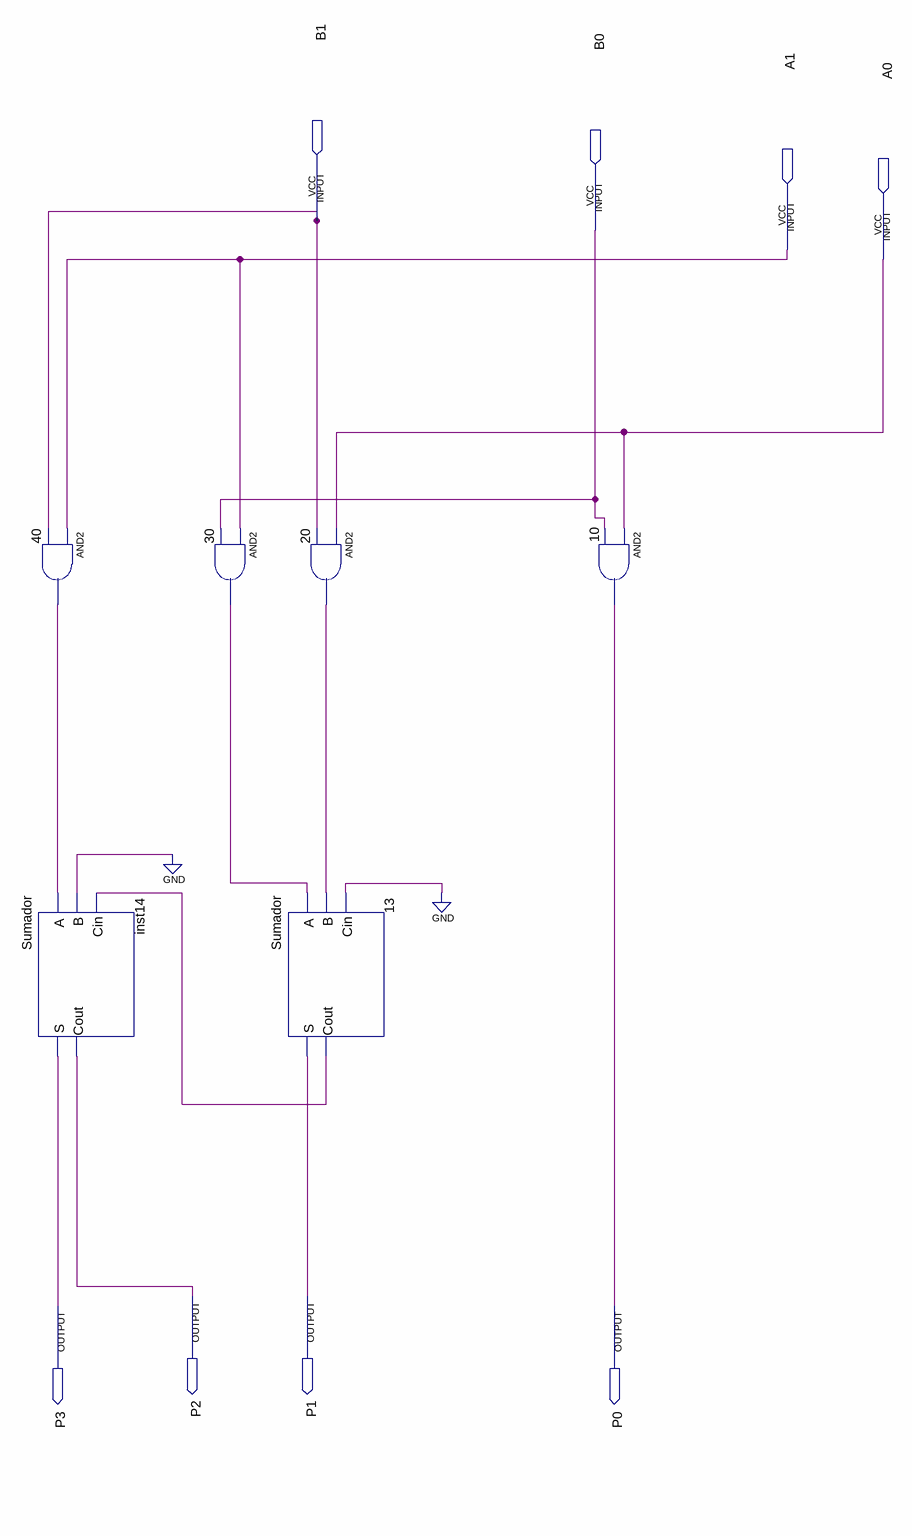
[diagram p0: schematic sheet]
// Quartus schematic MultiplicadorBlock.bdf as structural Verilog: 6 symbols, 8 pins
module MultiplicadorBlock (
  input  B1,
  input  B0,
  input  A1,
  input  A0,
  output P2,
  output P1,
  output P3,
  output P0
);

  wire n13_cout, n20_out, n30_out, n40_out;

  and u_40 (n40_out, A1, B1);
  Sumador inst14 (.A(n40_out), .B(1'b0), .Cin(n13_cout), .S(P3), .Cout(P2));
  and u_30 (n30_out, A1, B0);
  and u_20 (n20_out, A0, B1);
  Sumador u_13 (.A(n30_out), .B(n20_out), .Cin(1'b0), .S(P1), .Cout(n13_cout));
  and u_10 (P0, A0, B0);
endmodule
